# Altium project FlatSat Half 1.PrjPcb (part 2 of 2)
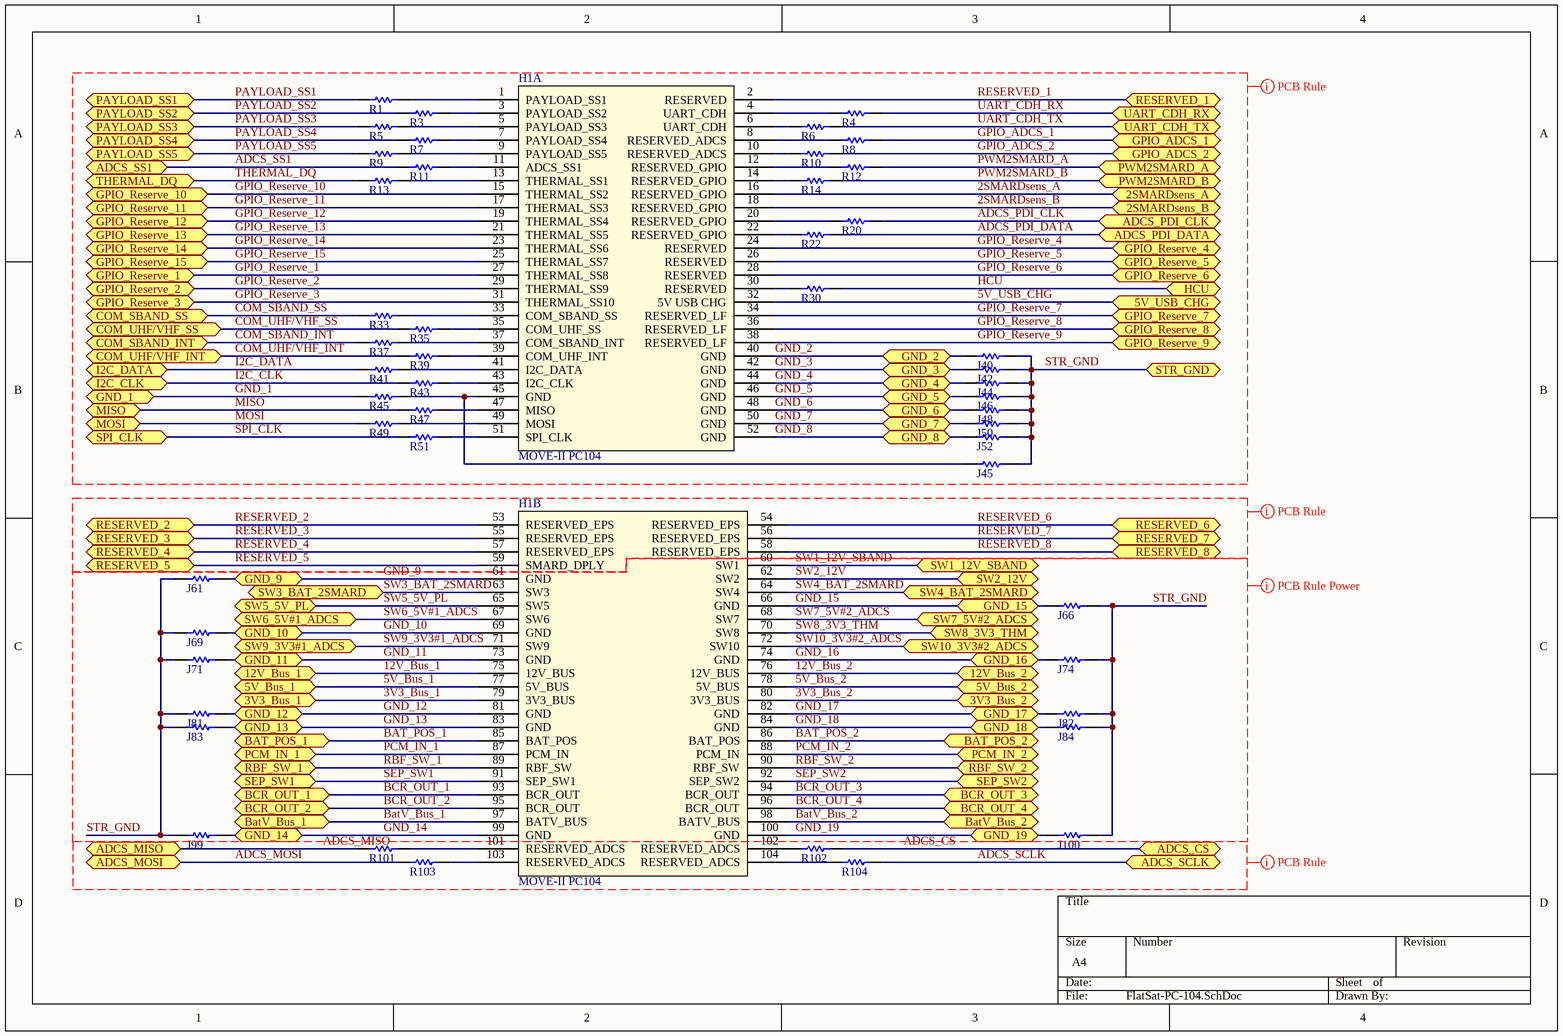
[diagram p3: FlatSat-PC-104.SchDoc]

## Nets that join several sheets
2SMARDsens_A: A (H1_A.16), B (H1_B.16), C (H1_C.16), E (H1_E.16), H (H1_H.16)
2SMARDsens_B: A (H1_A.18), B (H1_B.18), C (H1_C.18), E (H1_E.18), H (H1_H.18)
3V3_Bus_1: A (H1_A.79), B (H1_B.79), C (H1_C.79), E (H1_E.79), H (H1_H.79)
3V3_Bus_2: A (H1_A.80), B (H1_B.80), C (H1_C.80), E (H1_E.80), H (H1_H.80)
5V_Bus_1: A (H1_A.77), B (H1_B.77), C (H1_C.77), E (H1_E.77), H (H1_H.77)
5V_Bus_2: A (H1_A.78), B (H1_B.78), C (H1_C.78), E (H1_E.78), H (H1_H.78)
5V_USB_CHG: A (H1_A.32), B (H1_B.32), C (H1_C.32), E (H1_E.32), H (H1_H.32)
12V_Bus_1: A (H1_A.75), B (H1_B.75), C (H1_C.75), E (H1_E.75), H (H1_H.75)
12V_Bus_2: A (H1_A.76), B (H1_B.76), C (H1_C.76), E (H1_E.76), H (H1_H.76)
ADCS_CS: A (R102_A.1), B (R102_B.1), C (R102_C.1), E (R102_E.1), H (R102_H.1)
ADCS_MISO: A (R101_A.2), B (R101_B.2), C (R101_C.2), E (R101_E.2), H (R101_H.2)
ADCS_MOSI: A (R103_A.1), B (R103_B.1), C (R103_C.1), E (R103_E.1), H (R103_H.1)
ADCS_PDI_CLK: A (R20_A.2), B (R20_B.2), C (R20_C.2), E (R20_E.2), H (R20_H.2)
ADCS_PDI_DATA: A (R22_A.2), B (R22_B.2), C (R22_C.2), E (R22_E.2), H (R22_H.2)
ADCS_SCLK: A (R104_A.2), B (R104_B.2), C (R104_C.2), E (R104_E.2), H (R104_H.2)
ADCS_SS1: A (R11_A.1), B (R11_B.1), C (R11_C.1), E (R11_E.1), H (R11_H.1)
BAT_POS_1: A (H1_A.85), B (H1_B.85), C (H1_C.85), E (H1_E.85), H (H1_H.85)
BAT_POS_2: A (H1_A.86), B (H1_B.86), C (H1_C.86), E (H1_E.86), H (H1_H.86)
BatV_Bus_1: A (H1_A.97), B (H1_B.97), C (H1_C.97), E (H1_E.97), H (H1_H.97)
BatV_Bus_2: A (H1_A.98), B (H1_B.98), C (H1_C.98), E (H1_E.98), H (H1_H.98)
BCR_OUT_1: A (H1_A.93), B (H1_B.93), C (H1_C.93), E (H1_E.93), H (H1_H.93)
BCR_OUT_2: A (H1_A.95), B (H1_B.95), C (H1_C.95), E (H1_E.95), H (H1_H.95)
BCR_OUT_3: A (H1_A.94), B (H1_B.94), C (H1_C.94), E (H1_E.94), H (H1_H.94)
BCR_OUT_4: A (H1_A.96), B (H1_B.96), C (H1_C.96), E (H1_E.96), H (H1_H.96)
COM_SBAND_INT: A (R37_A.1), B (R37_B.1), C (R37_C.1), E (R37_E.1), H (R37_H.1)
COM_SBAND_SS: A (R33_A.1), B (R33_B.1), C (R33_C.1), E (R33_E.1), H (R33_H.1)
COM_UHF/VHF_INT: A (R39_A.1), B (R39_B.1), C (R39_C.1), E (R39_E.1), H (R39_H.1)
COM_UHF/VHF_SS: A (R35_A.2), B (R35_B.2), C (R35_C.2), E (R35_E.2), H (R35_H.2)
GND_1: A (R45_A.1), B (R45_B.1), C (R45_C.1), E (R45_E.1), H (R45_H.1)
GND_2: A (H1_A.40 J40_A.1), B (H1_B.40 J40_B.1), C (H1_C.40 J40_C.1), E (H1_E.40 J40_E.1), H (H1_H.40 J40_H.1)
GND_3: A (H1_A.42 J42_A.1), B (H1_B.42 J42_B.1), C (H1_C.42 J42_C.1), E (H1_E.42 J42_E.1), H (H1_H.42 J42_H.1)
GND_4: A (H1_A.44 J44_A.1), B (H1_B.44 J44_B.1), C (H1_C.44 J44_C.1), E (H1_E.44 J44_E.1), H (H1_H.44 J44_H.1)
GND_5: A (H1_A.46 J46_A.1), B (H1_B.46 J46_B.1), C (H1_C.46 J46_C.1), E (H1_E.46 J46_E.1), H (H1_H.46 J46_H.1)
GND_6: A (H1_A.48 J48_A.1), B (H1_B.48 J48_B.1), C (H1_C.48 J48_C.1), E (H1_E.48 J48_E.1), H (H1_H.48 J48_H.1)
GND_7: A (H1_A.50 J50_A.1), B (H1_B.50 J50_B.1), C (H1_C.50 J50_C.1), E (H1_E.50 J50_E.1), H (H1_H.50 J50_H.1)
GND_8: A (H1_A.52 J52_A.1), B (H1_B.52 J52_B.1), C (H1_C.52 J52_C.1), E (H1_E.52 J52_E.1), H (H1_H.52 J52_H.1)
GND_9: A (H1_A.61 J61_A.2), B (H1_B.61 J61_B.2), C (H1_C.61 J61_C.2), E (H1_E.61 J61_E.2), H (H1_H.61 J61_H.2)
GND_10: A (H1_A.69 J69_A.2), B (H1_B.69 J69_B.2), C (H1_C.69 J69_C.2), E (H1_E.69 J69_E.2), H (H1_H.69 J69_H.2)
GND_11: A (H1_A.73 J71_A.2), B (H1_B.73 J71_B.2), C (H1_C.73 J71_C.2), E (H1_E.73 J71_E.2), H (H1_H.73 J71_H.2)
GND_12: A (H1_A.81 J81_A.2), B (H1_B.81 J81_B.2), C (H1_C.81 J81_C.2), E (H1_E.81 J81_E.2), H (H1_H.81 J81_H.2)
GND_13: A (H1_A.83 J83_A.2), B (H1_B.83 J83_B.2), C (H1_C.83 J83_C.2), E (H1_E.83 J83_E.2), H (H1_H.83 J83_H.2)
GND_14: A (H1_A.99 J99_A.2), B (H1_B.99 J99_B.2), C (H1_C.99 J99_C.2), E (H1_E.99 J99_E.2), H (H1_H.99 J99_H.2)
GND_15: A (H1_A.66 J66_A.1), B (H1_B.66 J66_B.1), C (H1_C.66 J66_C.1), E (H1_E.66 J66_E.1), H (H1_H.66 J66_H.1)
GND_16: A (H1_A.74 J74_A.1), B (H1_B.74 J74_B.1), C (H1_C.74 J74_C.1), E (H1_E.74 J74_E.1), H (H1_H.74 J74_H.1)
GND_17: A (H1_A.82 J82_A.1), B (H1_B.82 J82_B.1), C (H1_C.82 J82_C.1), E (H1_E.82 J82_E.1), H (H1_H.82 J82_H.1)
GND_18: A (H1_A.84 J84_A.1), B (H1_B.84 J84_B.1), C (H1_C.84 J84_C.1), E (H1_E.84 J84_E.1), H (H1_H.84 J84_H.1)
GND_19: A (H1_A.100 J100_A.1), B (H1_B.100 J100_B.1), C (H1_C.100 J100_C.1), E (H1_E.100 J100_E.1), H (H1_H.100 J100_H.1)
GPIO_ADCS_1: A (R8_A.2), B (R8_B.2), C (R8_C.2), E (R8_E.2), H (R8_H.2)
GPIO_ADCS_2: A (R10_A.2), B (R10_B.2), C (R10_C.2), E (R10_E.2), H (R10_H.2)
GPIO_Reserve_1: A (H1_A.27), B (H1_B.27), C (H1_C.27), E (H1_E.27), H (H1_H.27)
GPIO_Reserve_2: A (H1_A.29), B (H1_B.29), C (H1_C.29), E (H1_E.29), H (H1_H.29)
GPIO_Reserve_3: A (H1_A.31), B (H1_B.31), C (H1_C.31), E (H1_E.31), H (H1_H.31)
GPIO_Reserve_4: A (H1_A.24), B (H1_B.24), C (H1_C.24), E (H1_E.24), H (H1_H.24)
GPIO_Reserve_5: A (H1_A.26), B (H1_B.26), C (H1_C.26), E (H1_E.26), H (H1_H.26)
GPIO_Reserve_6: A (H1_A.28), B (H1_B.28), C (H1_C.28), E (H1_E.28), H (H1_H.28)
GPIO_Reserve_7: A (H1_A.34), B (H1_B.34), C (H1_C.34), E (H1_E.34), H (H1_H.34)
GPIO_Reserve_8: A (H1_A.36), B (H1_B.36), C (H1_C.36), E (H1_E.36), H (H1_H.36)
GPIO_Reserve_9: A (H1_A.38), B (H1_B.38), C (H1_C.38), E (H1_E.38), H (H1_H.38)
GPIO_Reserve_10: A (H1_A.15), B (H1_B.15), C (H1_C.15), E (H1_E.15), H (H1_H.15)
GPIO_Reserve_11: A (H1_A.17), B (H1_B.17), C (H1_C.17), E (H1_E.17), H (H1_H.17)
GPIO_Reserve_12: A (H1_A.19), B (H1_B.19), C (H1_C.19), E (H1_E.19), H (H1_H.19)
GPIO_Reserve_13: A (H1_A.21), B (H1_B.21), C (H1_C.21), E (H1_E.21), H (H1_H.21)
GPIO_Reserve_14: A (H1_A.23), B (H1_B.23), C (H1_C.23), E (H1_E.23), H (H1_H.23)
GPIO_Reserve_15: A (H1_A.25), B (H1_B.25), C (H1_C.25), E (H1_E.25), H (H1_H.25)
HCU: A (R30_A.2), B (R30_B.2), C (R30_C.2), E (R30_E.2), H (R30_H.2)
I2C_CLK: A (R43_A.1), B (R43_B.1), C (R43_C.1), E (R43_E.1), H (R43_H.1)
I2C_DATA: A (R41_A.1), B (R41_B.1), C (R41_C.1), E (R41_E.1), H (R41_H.1)
MISO: A (R47_A.1), B (R47_B.1), C (R47_C.1), E (R47_E.1), H (R47_H.1)
MOSI: A (R49_A.1), B (R49_B.1), C (R49_C.1), E (R49_E.1), H (R49_H.1)
PAYLOAD_SS1: A (R1_A.1), B (R1_B.1), C (R1_C.1), E (R1_E.1), H (R1_H.1)
PAYLOAD_SS2: A (R3_A.1), B (R3_B.1), C (R3_C.1), E (R3_E.1), H (R3_H.1)
PAYLOAD_SS3: A (R5_A.1), B (R5_B.1), C (R5_C.1), E (R5_E.1), H (R5_H.1)
PAYLOAD_SS4: A (R7_A.1), B (R7_B.1), C (R7_C.1), E (R7_E.1), H (R7_H.1)
PAYLOAD_SS5: A (R9_A.1), B (R9_B.1), C (R9_C.1), E (R9_E.1), H (R9_H.1)
PCM_IN_1: A (H1_A.87), B (H1_B.87), C (H1_C.87), E (H1_E.87), H (H1_H.87)
PCM_IN_2: A (H1_A.88), B (H1_B.88), C (H1_C.88), E (H1_E.88), H (H1_H.88)
PWM2SMARD_A: A (R12_A.2), B (R12_B.2), C (R12_C.2), E (R12_E.2), H (R12_H.2)
PWM2SMARD_B: A (R14_A.2), B (R14_B.2), C (R14_C.2), E (R14_E.2), H (R14_H.2)
RBF_SW_1: A (H1_A.89), B (H1_B.89), C (H1_C.89), E (H1_E.89), H (H1_H.89)
RBF_SW_2: A (H1_A.90), B (H1_B.90), C (H1_C.90), E (H1_E.90), H (H1_H.90)
RESERVED_1: A (H1_A.2), B (H1_B.2), C (H1_C.2), E (H1_E.2), H (H1_H.2)
RESERVED_2: A (H1_A.53), B (H1_B.53), C (H1_C.53), E (H1_E.53), H (H1_H.53)
RESERVED_3: A (H1_A.55), B (H1_B.55), C (H1_C.55), E (H1_E.55), H (H1_H.55)
RESERVED_4: A (H1_A.57), B (H1_B.57), C (H1_C.57), E (H1_E.57), H (H1_H.57)
RESERVED_5: A (H1_A.59), B (H1_B.59), C (H1_C.59), E (H1_E.59), H (H1_H.59)
RESERVED_6: A (H1_A.54), B (H1_B.54), C (H1_C.54), E (H1_E.54), H (H1_H.54)
RESERVED_7: A (H1_A.56), B (H1_B.56), C (H1_C.56), E (H1_E.56), H (H1_H.56)
RESERVED_8: A (H1_A.58), B (H1_B.58), C (H1_C.58), E (H1_E.58), H (H1_H.58)
SEP_SW1: A (H1_A.91), B (H1_B.91), C (H1_C.91), E (H1_E.91), H (H1_H.91)
SEP_SW2: A (H1_A.92), B (H1_B.92), C (H1_C.92), E (H1_E.92), H (H1_H.92)
SPI_CLK: A (R51_A.1), B (R51_B.1), C (R51_C.1), E (R51_E.1), H (R51_H.1)
STR_GND: A (19 pins), B (19 pins), C (19 pins), E (19 pins), H (19 pins)
SW1_12V_SBAND: A (H1_A.60), B (H1_B.60), C (H1_C.60), E (H1_E.60), H (H1_H.60)
SW2_12V: A (H1_A.62), B (H1_B.62), C (H1_C.62), E (H1_E.62), H (H1_H.62)
SW3_BAT_2SMARD: A (H1_A.63), B (H1_B.63), C (H1_C.63), E (H1_E.63), H (H1_H.63)
SW4_BAT_2SMARD: A (H1_A.64), B (H1_B.64), C (H1_C.64), E (H1_E.64), H (H1_H.64)
SW5_5V_PL: A (H1_A.65), B (H1_B.65), C (H1_C.65), E (H1_E.65), H (H1_H.65)
SW6_5V#1_ADCS: A (H1_A.67), B (H1_B.67), C (H1_C.67), E (H1_E.67), H (H1_H.67)
SW7_5V#2_ADCS: A (H1_A.68), B (H1_B.68), C (H1_C.68), E (H1_E.68), H (H1_H.68)
SW8_3V3_THM: A (H1_A.70), B (H1_B.70), C (H1_C.70), E (H1_E.70), H (H1_H.70)
SW9_3V3#1_ADCS: A (H1_A.71), B (H1_B.71), C (H1_C.71), E (H1_E.71), H (H1_H.71)
SW10_3V3#2_ADCS: A (H1_A.72), B (H1_B.72), C (H1_C.72), E (H1_E.72), H (H1_H.72)
THERMAL_DQ: A (R13_A.1), B (R13_B.1), C (R13_C.1), E (R13_E.1), H (R13_H.1)
UART_CDH_RX: A (R4_A.2), B (R4_B.2), C (R4_C.2), E (R4_E.2), H (R4_H.2)
UART_CDH_TX: A (R6_A.2), B (R6_B.2), C (R6_C.2), E (R6_E.2), H (R6_H.2)